# Altium project LowPowerSymmetricalSupply.PrjPcb
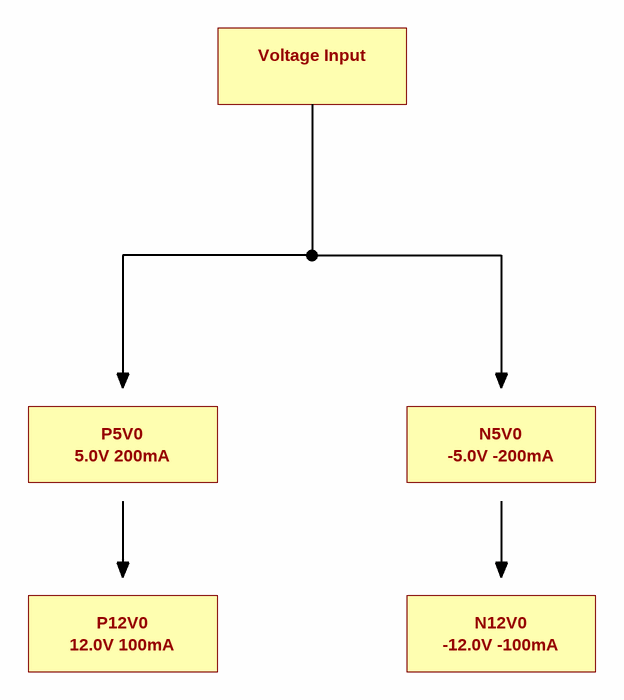
[diagram p0: LPSP_BlockDiagram.SchDoc]
4 sheets, 16 parts. Net scope: global (net labels, ports and power ports of the same name join across sheets).
Sheets:
  LPSP_Title.SchDoc
  LPSP_BlockDiagram.SchDoc
  LPSP_VoltageInput.SchDoc
  LPSP_N5V0.SchDoc

## Sheet LPSP_Title.SchDoc
size A3; Organization: Canis Tech; Address1: -; Address2: -; Address3: -; Address4: Indaiatuba/SP; Address5: Brazil

### Notes on the sheet
- Title
- Author
- Checked By
- Variant
- Size:
- Revision:
- A3
- Date:
- Project
- Time:
- Sheet
- of
- File:

## Sheet LPSP_BlockDiagram.SchDoc
size A3; Organization: Canis Tech; Address1: -; Address2: -; Address3: -; Address4: Indaiatuba/SP; Address5: Brazil

### Notes on the sheet
- Voltage Input
- P5V0
- 5.0V 200mA
- N5V0
- -5.0V -200mA
- P12V0
- 12.0V 100mA
- N12V0
- -12.0V -100mA
- Title
- Author
- Checked By
- Variant
- Size:
- Revision:
- A3
- Date:
- Project
- Time:
- Sheet
- of
- File:

## Sheet LPSP_VoltageInput.SchDoc
size A3; Organization: Canis Tech; Address1: -; Address2: -; Address3: -; Address4: Indaiatuba/SP; Address5: Brazil
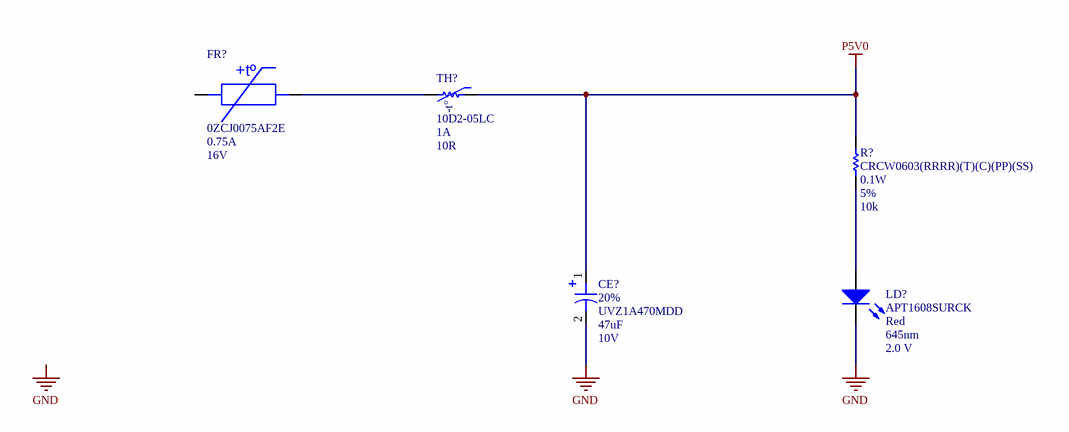
[diagram p1: LPSP_VoltageInput.SchDoc]

### Parts
(Parts that share a designator on the sheet are numbered #1, #2 ... from top to bottom, then left to right.)
CE?  value 47uF  Tolerance: 20%  PartNumber1: UVZ1A470MDD  Voltage: 10V  [2.0-5.0-11.0]  (hidden comment: 10V 47uF)
FR?  HoldCurrent: 0.75A  Voltage: 16V  [FUS1206]  (hidden comment: 0ZCJ0075AF2E)
LD?  Colour: Red  Wavelength: 645nm  Vled: 2.0 V  [LED0603]  (hidden comment: APT1608SURCK)
R?#1  value 10k  PartNumber1: CRCW0603(RRRR)(T)(C)(PP)(SS)  Power: 0.1W  Tolerance: 5%  [RES0603]  (hidden comment: Chip Resistor)
TH?  value 10R  Current: 1A  [NTC D2 DIA05mm]  (hidden comment: 10D2-05LC)

### Nets
GND: CE?.2 LD?.K
P5V0: CE?.1 R?#1.2 TH?.1
NetFR?_2: FR?.2 TH?.2
NetLD?_A: LD?.A R?#1.1

Not connected (* = marked no-connect by the designer): FR? 1

### Notes on the sheet
- Labels drawn without touching a wire or pin: GND
- Title
- Author
- Checked By
- Variant
- Size:
- Revision:
- A3
- Date:
- Project
- Time:
- Sheet
- of
- File:
- (in symbol 0ZCJ0075AF2E) +tº
- (in symbol 10D2-05LC) -t°

### Library data of the parts
CE? = 10V 47uF: Electrolytic Capacitor PTH; Manufacturer1: Nichicon; Code: 470; Published: 26-Dec-2016; LatestRevisionDate: 26-Dec-2016; PackageReference: 2-5; Publisher: Lucas Moraes; PackageDescription: 2-5;2 leads; LatestRevisionNote: Created
FR? = 0ZCJ0075AF2E: PPTC 0ZCJ Series 1206 - 0.75A 16V; Manufacturer1: Bel; Published: 19-Dec-2024; LatestRevisionDate: 19-Dec-2024; LatestRevisionNote: Created; PackageReference: FUS1206; Publisher: Lucas Moraes; PackageDescription: FUS1206; 2 Leads; PartNumber1: 0ZCJ0075AF2E
LD? = APT1608SURCK: Standard LEDs - SMD 0603 Red; Manufacturer1: Kingbright; LastRevisionNote: Created; Published: 28-Mar-2023; PackageReference: LED0603; Publisher: Lucas Moraes; PackageDescription: LED0603; 2 leads; LastRevision: 28-Mar-2023; Datasheet: https://www.mouser.com/datasheet/2/216/APT1608SURCK-41133.pdf; PartNumber1: APT1608SURCK
R?#1 = CRCW0603: Thick Film Chip Resistors with CECC Approval,  available with Established Reliability; Manufacturer1: Vishay; LatestRevisionDate: 06-May-2016; PackageReference: 0603; Publisher: Lucas Moraes; PackageDescription: SMD 0603; 2 Leads; Published: 06-May-2016
TH? = 10D2-05LC: NTC Thermistors Semitec Clinch lead; LatestRevisionDate: 26-Nov-2022; PackageReference: NTC D2 DIA05mm; Publisher: Lucas Moraes; PackageDescription: NTC D2 DIA05mm; 2 Leads; Published: 26-Nov-2022; Manufacturer1: Semitec; PartNumber1: 10D2-05LC

## Sheet LPSP_N5V0.SchDoc
size A3; Organization: Canis Tech; Address1: -; Address2: -; Address3: -; Address4: Indaiatuba/SP; Address5: Brazil
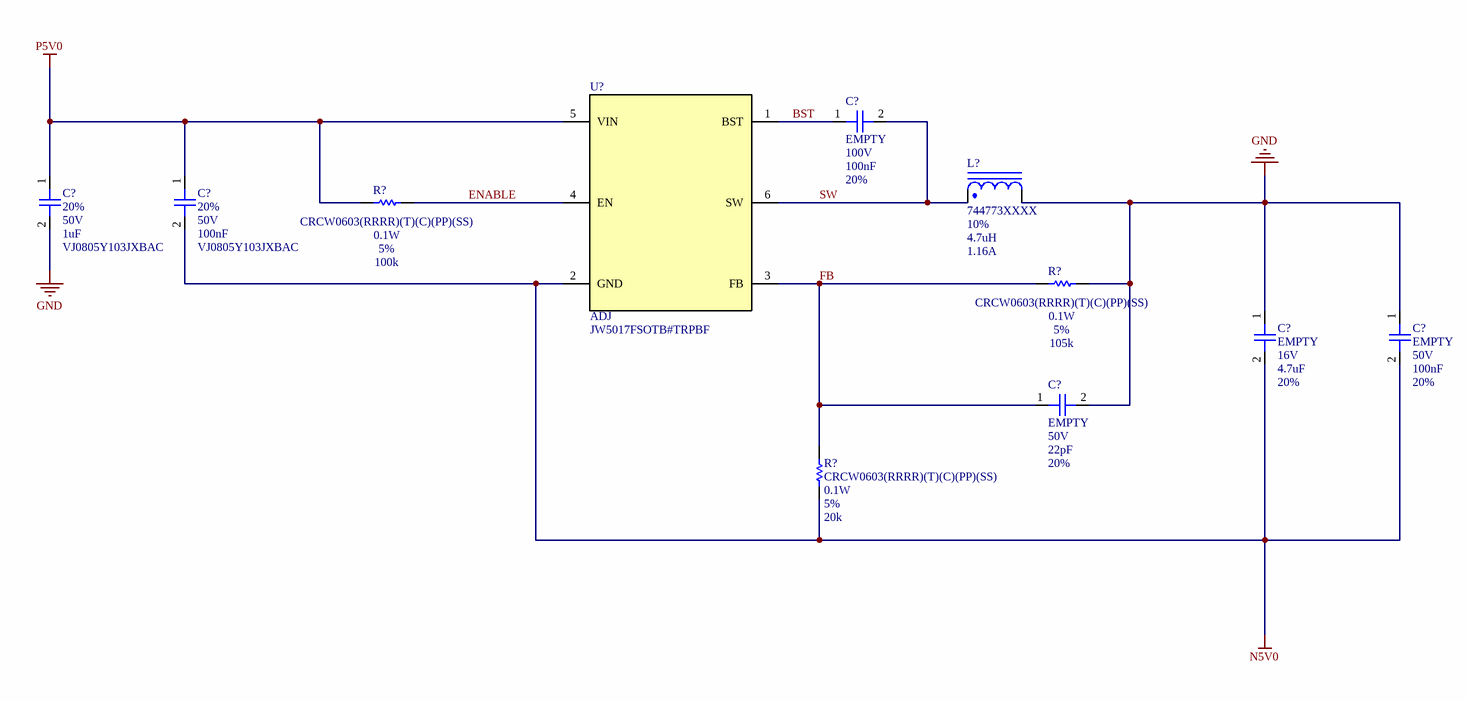
[diagram p2: LPSP_N5V0.SchDoc]

### Parts
(Parts that share a designator on the sheet are numbered #1, #2 ... from top to bottom, then left to right.)
C?#1  value 100nF  PartNumber1: EMPTY  Voltage: 100V  Tolerance: 20%  [CAP0603]  (hidden comment: CC0603)
C?#2  value 1uF  Tolerance: 20%  Voltage: 50V  PartNumber1: VJ0805Y103JXBAC  [CAP0805]  (hidden comment: VJ Series)
C?#3  value 100nF  Tolerance: 20%  Voltage: 50V  PartNumber1: VJ0805Y103JXBAC  [CAP0805]  (hidden comment: VJ Series)
C?#4  value 4.7uF  PartNumber1: EMPTY  Voltage: 16V  Tolerance: 20%  [CAP0603]  (hidden comment: CC0603)
C?#5  value 100nF  PartNumber1: EMPTY  Voltage: 50V  Tolerance: 20%  [CAP0603]  (hidden comment: CC0603)
C?#6  value 22pF  PartNumber1: EMPTY  Voltage: 50V  Tolerance: 20%  [CAP0603]  (hidden comment: CC0603)
L?  value 4.7uH  PartNumber1: 744773XXXX  Tolerance: 10%  Current: 1.16A  [WE-PD2-3521]  (hidden comment: WE-PD2 3521)
R?#2  value 100k  PartNumber1: CRCW0603(RRRR)(T)(C)(PP)(SS)  Power: 0.1W  Tolerance: 5%  [RES0603]  (hidden comment: Chip Resistor)
R?#3  value 105k  PartNumber1: CRCW0603(RRRR)(T)(C)(PP)(SS)  Power: 0.1W  Tolerance: 5%  [RES0603]  (hidden comment: Chip Resistor)
R?#4  value 20k  PartNumber1: CRCW0603(RRRR)(T)(C)(PP)(SS)  Power: 0.1W  Tolerance: 5%  [RES0603]  (hidden comment: Chip Resistor)
U?  Voltage: ADJ  PartNumber1: JW5017FSOTB#TRPBF  [SOT-23-6]  (hidden comment: JW5017F)

### Nets
GND: C?#2.2 C?#4.1 C?#5.1 C?#6.2 L?.2 R?#3.2
N5V0: C?#3.2 C?#4.2 C?#5.2 R?#4.2 U?.2(GND)
P5V0: C?#2.1 C?#3.1 R?#2.2 U?.5(VIN)
BST: C?#1.1 U?.1(BST)
ENABLE: R?#2.1 U?.4(EN)
FB: C?#6.1 R?#3.1 R?#4.1 U?.3(FB)
SW: C?#1.2 L?.1 U?.6(SW)

### Notes on the sheet
- Title
- Author
- Checked By
- Variant
- Size:
- Revision:
- A3
- Date:
- Project
- Time:
- Sheet
- of
- File:

### Library data of the parts
C?#1 C?#4-C?#6 = CC0603: Surface Mount Multilayer Ceramic Chip Capacitors  for Commercial Applications; Manufacturer1: Yageo; Published: 19-Jun-2016; LatestRevisionDate: 19-Jun-2016; Publisher: Lucas Moraes; PackageReference: CAP0603; PackageDescription: CAP0603;2 Leads
C?#2 C?#3 = VJ0805: Surface Mount Multilayer Ceramic Chip Capacitors  for Commercial Applications; Manufacturer1: Vishay; Published: 19-Jun-2016; LatestRevisionDate: 19-Jun-2016; Publisher: Lucas Moraes; PackageReference: CAP0805; PackageDescription: CAP0805;2 Leads; Datasheet: http://www.mouser.com/ds/2/427/vjcommercialseries-222796.pdf
L? = WE-PD2 3521: Fixed Inductors WE-PD2 3521; Manufacturer1: Wurth Elektronik; LatestRevisionDate: 22-Mar-2022; PackageReference: WE-PD2 3521; Publisher: Lucas Moraes; PackageDescription: WE-PD2 3521; 2 Leads; Published: 22-Mar-2022; Datasheet: https://www.we-online.com/catalog/en/WE-PD2
R?#2-R?#4 = CRCW0603: as R?#1 on sheet LPSP_VoltageInput; LatestRevisionDate: 06-May-2016; PackageReference: 0603; Publisher: Lucas Moraes; PackageDescription: SMD 0603; 2 Leads; Published: 06-May-2016
U? = JW5017F: 1.2A, 26V Synchronous Step-Down Converter; Manufacturer1: JOULWATT; Current: 1.2A; LatestRevisionDate: 08-Jan-2022; LatestRevisionNote: Created; PackageDescription: SOT-23-6;6 Leads; PackageReference: SOT-23-6; Published: 08-Jan-2022; Publisher: Lucas Moraes

## Nets that join several sheets
GND: LPSP_VoltageInput (CE?.2 LD?.K), LPSP_N5V0 (6 pins)
P5V0: LPSP_VoltageInput (CE?.1 R?#1.2 TH?.1), LPSP_N5V0 (C?#2.1 C?#3.1 R?#2.2 U?.5)